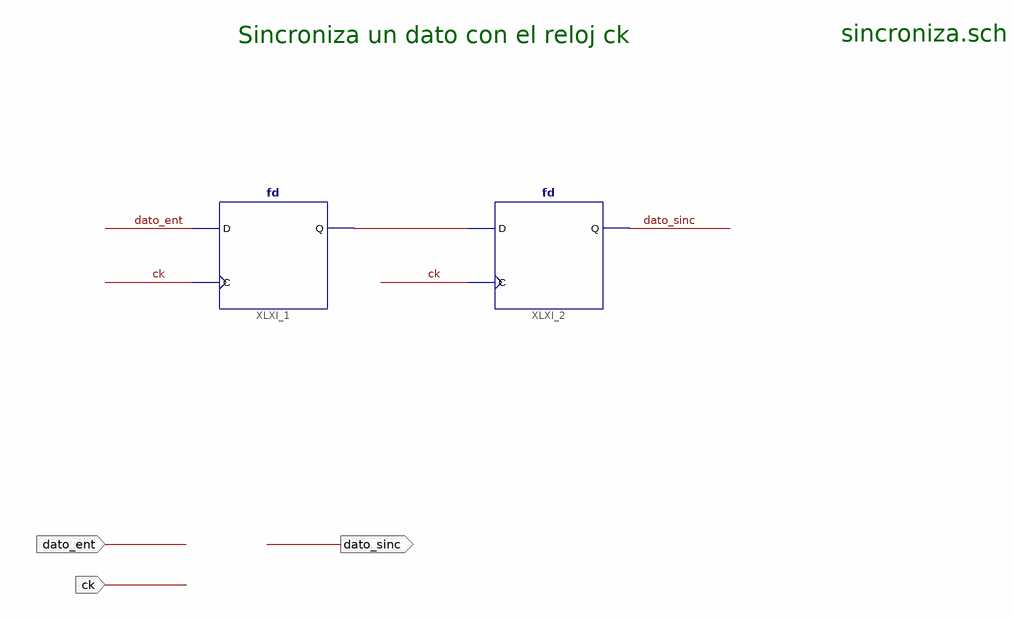
[diagram p0: schematic sheet 1]
// Xilinx ISE schematic sincroniza.sch (spartan6) as structural Verilog: 2 symbols, 3 ports
module sincroniza (
  input  ck,
  input  dato_ent,
  output dato_sinc
);

  wire XLXN_4;

  fd XLXI_1 (.C(ck), .D(dato_ent), .Q(XLXN_4));
  fd XLXI_2 (.C(ck), .D(XLXN_4), .Q(dato_sinc));

  // Notes on the sheet:
  //   sincroniza.sch
  //   Sincroniza un dato con el reloj ck
endmodule
